# EAGLE schematic 1_Schematic_Prototipagem v3 (EAGLE 9.7.0)
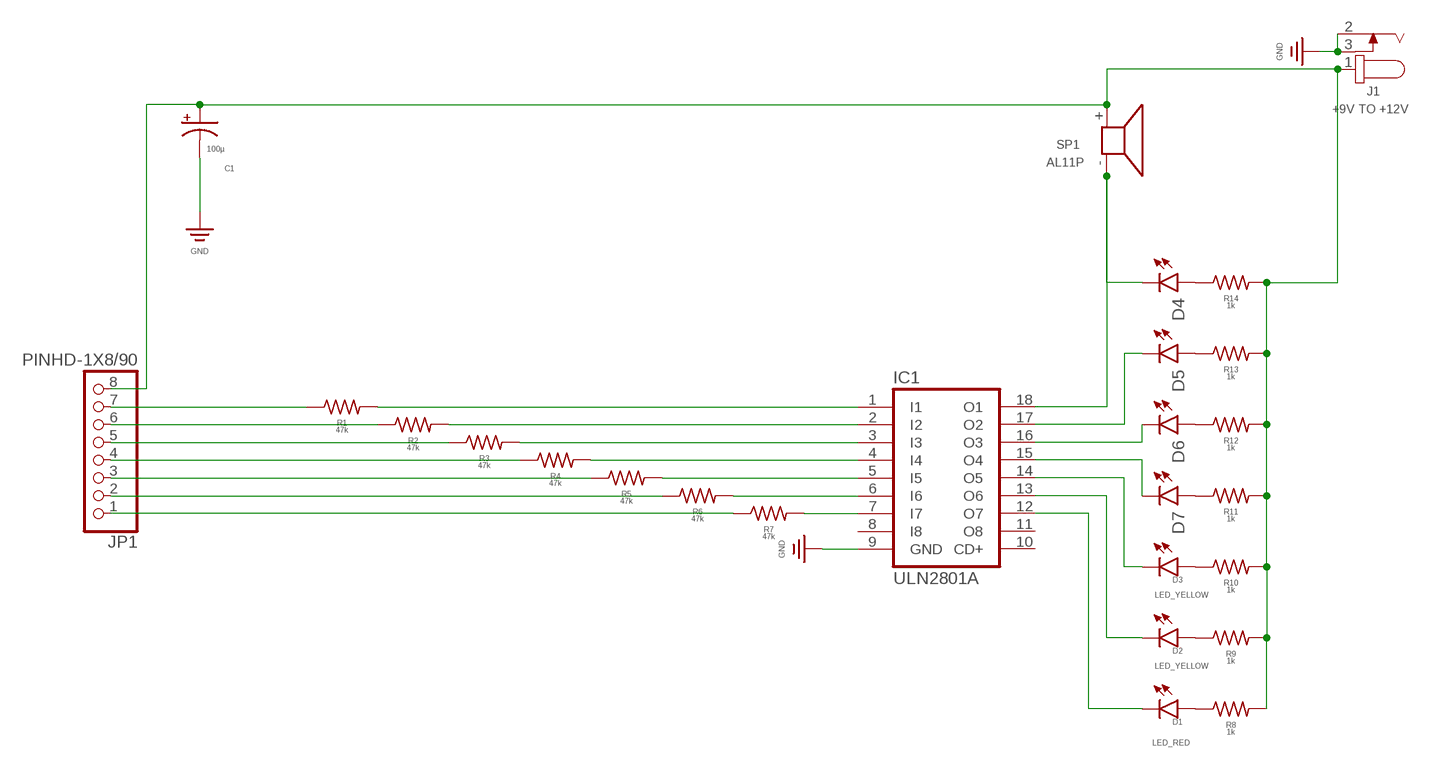
[diagram p0: schematic, sheet 1]

## Parts
C1  100µ  C-POL-US_RADIAL-11MM-DIA  [CAPPRD508W65D1000H1100B]
D1  LED_RED  LED_RADIAL_RED  [LEDRD254W60D565H860B]
D2  LED_YELLOW  LED_RADIAL_YELLOW  [LEDRD254W60D565H860B_Y]
D3  LED_YELLOW  LED_RADIAL_YELLOW  [LEDRD254W60D565H860B_Y]
D4  LED_RADIAL  [LEDRD254W60D565H860B_G]
D5  LED_RADIAL  [LEDRD254W60D565H860B_G]
D6  LED_RADIAL  [LEDRD254W60D565H860B_G]
D7  LED_RADIAL  [LEDRD254W60D565H860B_G]
IC1  ULN2801A  [DIL18]
J1  +9V TO +12V  694106402002  [694106402002]
JP1  PINHD-1X8/90  [1X08/90]
R1  47k  R-US_AXIAL-11.7MM-PITCH  [RESAD1176W63L850D250B]
R2  47k  R-US_AXIAL-11.7MM-PITCH  [RESAD1176W63L850D250B]
R3  47k  R-US_AXIAL-11.7MM-PITCH  [RESAD1176W63L850D250B]
R4  47k  R-US_AXIAL-11.7MM-PITCH  [RESAD1176W63L850D250B]
R5  47k  R-US_AXIAL-11.7MM-PITCH  [RESAD1176W63L850D250B]
R6  47k  R-US_AXIAL-11.7MM-PITCH  [RESAD1176W63L850D250B]
R7  47k  R-US_AXIAL-11.7MM-PITCH  [RESAD1176W63L850D250B]
R8  1k  R-US_AXIAL-11.7MM-PITCH  [RESAD1176W63L850D250B]
R9  1k  R-US_AXIAL-11.7MM-PITCH  [RESAD1176W63L850D250B]
R10  1k  R-US_AXIAL-11.7MM-PITCH  [RESAD1176W63L850D250B]
R11  1k  R-US_AXIAL-11.7MM-PITCH  [RESAD1176W63L850D250B]
R12  1k  R-US_AXIAL-11.7MM-PITCH  [RESAD1176W63L850D250B]
R13  1k  R-US_AXIAL-11.7MM-PITCH  [RESAD1176W63L850D250B]
R14  1k  R-US_AXIAL-11.7MM-PITCH  [RESAD1176W63L850D250B]
SP1  AL11P  [AL11P]

## Nets
GND: C1.2(-) IC1.9(GND) J1.2 J1.3
N$1: IC1.1(I1) R1.2
N$2: IC1.2(I2) R2.2
N$3: IC1.3(I3) R3.2
N$4: IC1.4(I4) R4.2
N$5: IC1.5(I5) R5.2
N$6: IC1.6(I6) R6.2
N$7: IC1.7(I7) R7.2
N$8: D1.2(C) IC1.12(O7)
N$9: D2.2(C) IC1.13(O6)
N$10: D3.2(C) IC1.14(O5)
N$11: D7.2(C) IC1.15(O4)
N$12: D6.2(C) IC1.16(O3)
N$13: D5.2(C) IC1.17(O2)
N$14: D4.2(C) IC1.18(O1) SP1.-
N$15: D4.1(A) R14.1
N$16: JP1.1 R7.1
N$17: JP1.2 R6.1
N$18: JP1.3 R5.1
N$19: JP1.4 R4.1
N$20: JP1.5 R3.1
N$21: JP1.6 R2.1
N$22: JP1.7 R1.1
N$23: D1.1(A) R8.1
N$24: D2.1(A) R9.1
N$25: D3.1(A) R10.1
N$26: D5.1(A) R13.1
N$27: D6.1(A) R12.1
N$28: D7.1(A) R11.1
N$30: C1.1(+) J1.1 JP1.8 R8.2 R9.2 R10.2 R11.2 R12.2 R13.2 R14.2 SP1.+
Unconnected: IC1.8(I8) IC1.10(CD+) IC1.11(O8)

## Library data of the parts
C1 = Capacitor:C-POL-US: Capacitor Polarised - ANSI; CATEGORY: Capacitor
D1-D3 = Opto-Electronic:LED_RADIAL: LED - Generic; CATEGORY: Opto-Electronic; SUB-CATEGORY: LED
D4-D7 = Library:LED_RADIAL: LED - Generic
IC1 = uln-udn:ULN2801A: DRIVER ARRAY
J1 = Connector:694106402002: DC POWER JACK - VERTICAL - THT - 2.0 & 2.5Ø - WR-DC Details see: Datasheet <https://katalog.we-online.com/en/em/DC_THT_VERTICAL_6_4_69410X402002>; CATEGORY: Connector; DESCRIPTION: DC POWER JACK - VERTICAL - THT - 2.0 & 2.5Ø - WR-DC; MANUFACTURER: Würth Elektronik; MPN: 694106402002; OPERATING_TEMPERATURE: -40°C to +85°C; PART_STATUS: Active; ROHS_COMPLIANCE: RoHS Compliant; SERIES: WR-DC; SUBCATEGORY: Power Connector; TYPE: Vertical
JP1 = Connector:PINHD-1X8: PIN HEADER; CATEGORY: CONNECTOR; SUB-CATEGORY: PIN-HEADER
R1-R14 = Resistor:R-US: Resistor Fixed - ANSI; CATEGORY: Resistor; SUB-CATEGORY: Fixed
SP1 = buzzer:AL11P: SPEAKER Source: Buerklin; OC_FARNELL: unknown; OC_NEWARK: unknown